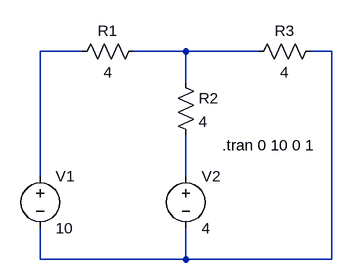
[diagram p0: schematic Draft1.asc]
Draft1.asc, the LTspice schematic file:
Version 4.1
SHEET 1 880 680
WIRE 16 96 -48 96
WIRE 176 96 96 96
WIRE 288 96 176 96
WIRE 400 96 368 96
WIRE 176 144 176 96
WIRE -48 288 -48 96
WIRE 176 288 176 224
WIRE -48 416 -48 368
WIRE 176 416 176 368
WIRE 176 416 -48 416
WIRE 400 416 400 96
WIRE 400 416 176 416
SYMBOL res 0 112 R270
WINDOW 0 32 56 VTop 2
WINDOW 3 0 56 VBottom 2
SYMATTR InstName R1
SYMATTR Value 4
SYMBOL res 160 128 R0
SYMATTR InstName R2
SYMATTR Value 4
SYMBOL res 272 112 R270
WINDOW 0 32 56 VTop 2
WINDOW 3 0 56 VBottom 2
SYMATTR InstName R3
SYMATTR Value 4
SYMBOL voltage -48 272 R0
WINDOW 123 0 0 Left 0
WINDOW 39 0 0 Left 0
SYMATTR InstName V1
SYMATTR Value 10
SYMBOL voltage 176 272 R0
WINDOW 123 0 0 Left 0
WINDOW 39 0 0 Left 0
SYMATTR InstName V2
SYMATTR Value 4
TEXT 232 240 Left 2 !.tran 0 10 0 1

The netlist it stands for:
* Draft1.asc
R1 N001 N002 4
R2 N002 N004 4
R3 N002 N003 4
V1 N001 N003 10
V2 N004 N003 4
.tran 0 10 0 1
.backanno
.end